# Altium schematic sheet MotorController.SchDoc: Motor Controller
size A3; Address1: Department of ECSE; Address2: The University of Auckland; Address3: 20 Symonds Street; Address4: Auckland, NZ; Revision: 1.0; SheetNumber: 3; SheetTotal: 3
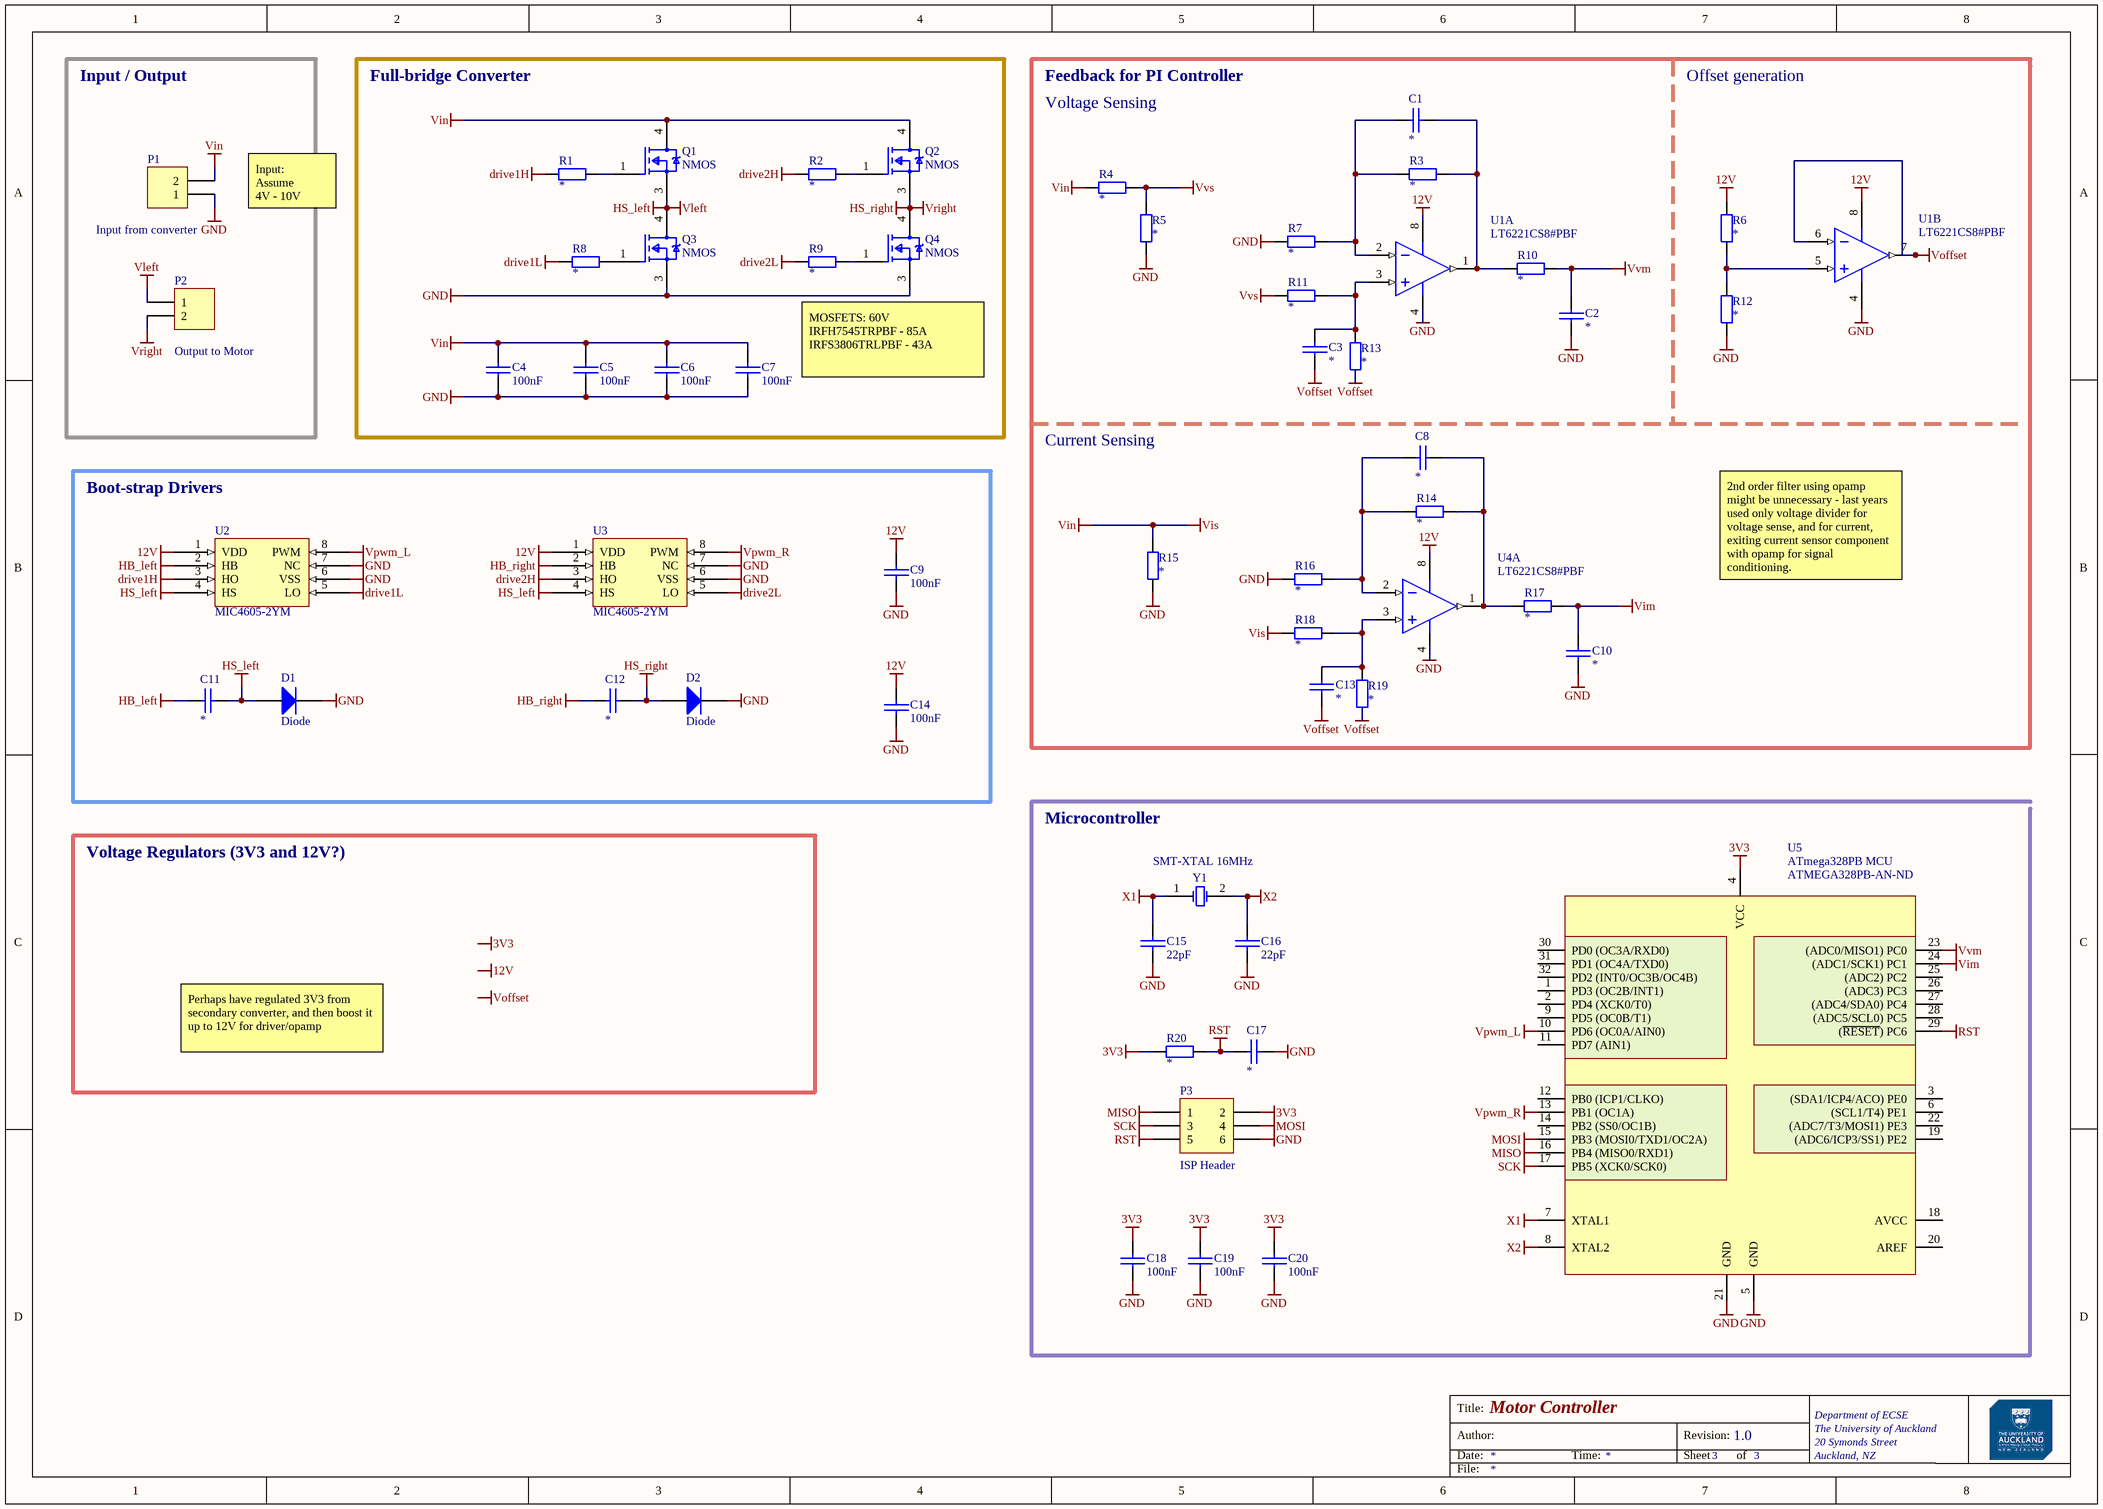
[diagram p0: MotorController.SchDoc]

## Parts
C1  *  [0805 CAP]
C2  *  [0805 CAP]
C3  *  [0805 CAP]
C4  100nF  [0805 CAP]
C5  100nF  [0805 CAP]
C6  100nF  [0805 CAP]
C7  100nF  [0805 CAP]
C8  *  [0805 CAP]
C9  100nF  [0805 CAP]
C10  *  [0805 CAP]
C11  *  [0805 CAP]
C12  *  [0805 CAP]
C13  *  [0805 CAP]
C14  100nF  [0805 CAP]
C15  22pF  [0805 CAP]
C16  22pF  [0805 CAP]
C17  *  [0805 CAP]
C18  100nF  [0805 CAP]
C19  100nF  [0805 CAP]
C20  100nF  [0805 CAP]
D1  Diode  [SMC]
D2  Diode  [SMC]
P1  Input from converter  [HDR1X2H]
P2  Output to Motor  [HDR1X2H]
P3  ISP Header  [HDR2X3]
Q1  NMOS  [IRFS3806TRLPBFCT-ND]
Q2  NMOS  [IRFS3806TRLPBFCT-ND]
Q3  NMOS  [IRFS3806TRLPBFCT-ND]
Q4  NMOS  [IRFS3806TRLPBFCT-ND]
R1  *  [0805 RES]
R2  *  [0805 RES]
R3  *  [0805 RES]
R4  *  [0805 RES]
R5  *  [0805 RES]
R6  *  [0805 RES]
R7  *  [0805 RES]
R8  *  [0805 RES]
R9  *  [0805 RES]
R10  *  [0805 RES]
R11  *  [0805 RES]
R12  *  [0805 RES]
R13  *  [0805 RES]
R14  *  [0805 RES]
R15  *  [0805 RES]
R16  *  [0805 RES]
R17  *  [0805 RES]
R18  *  [0805 RES]
R19  *  [0805 RES]
R20  *  [0805 RES]
U1  LT6221CS8#PBF  [LT-S8-8_N]  (parts A,B of 2)
U2  MIC4605-2YM
U3  MIC4605-2YM
U4  LT6221CS8#PBF  [LT-S8-8_N]  (part A of 2)
U5  ATmega328PB MCU  Supplier Part Number 1: ATMEGA328PB-AN-ND  [32 - TQFP]
Y1  SMT-XTAL 16MHz  [HC49-US]

## Blocks framed on the sheet
Input / Output: P1 P2
Full-bridge Converter: C4-C7 Q1-Q4 R1 R2 R8 R9
Boot-strap Drivers: C9 C11 C12 C14 D1 D2 U2 U3

## Nets
3V3: C18.1 C19.1 C20.1 P3.2 R20.2 U5.4(VCC)
12V: C9.2 C14.2 R6.2 U1.8(VS+) U2.1(VDD) U3.1(VDD) U4.8(VS+)
drive1H: R1.1 U2.3(HO)
drive1L: R8.1 U2.5(LO)
drive2H: R2.1 U3.3(HO)
drive2L: R9.1 U3.5(LO)
GND: C2.1 C4.1 C5.1 C6.1 C7.1 C9.1 C10.1 C14.1 C15.2 C16.2 C17.2 C18.2 C19.2 C20.2 D1.2(K) D2.2(K) P1.1 P3.6 Q3.3(S) Q4.3(S) R5.2 R7.1 R12.1 R15.2 R16.1 U1.4(VS-) U2.6(VSS) U2.7(NC) U3.6(VSS) U3.7(NC) U4.4(VS-) U5.5(GND) U5.21(GND)
HB_left: C11.1 U2.2(HB)
HB_right: C12.1 U3.2(HB)
HS_left: C11.2 D1.1(A) P2.1 Q1.3(S) Q3.4(D) U2.4(HS) U3.4(HS)  [also labelled Vleft]
HS_right: C12.2 D2.1(A) P2.2 Q2.3(S) Q4.4(D)  [also labelled Vright]
MISO: P3.1 U5.16(PB4_(MISO0/RXD1))
MOSI: P3.4 U5.15(PB3_(MOSI0/TXD1/OC2A))
RST: C17.1 P3.5 R20.1 U5.29((~{RESET})_PC6)
SCK: P3.3 U5.17(PB5_(XCK0/SCK0))
Vim: C10.2 R17.1 U5.24((ADC1/SCK1)_PC1)
Vin: C4.2 C5.2 C6.2 C7.2 P1.2 Q1.4(D) Q2.4(D) R4.2 R15.1 R18.1  [also labelled Vis]
Voffset: C3.1 C13.1 R13.1 R19.1 U1.6(-IN_B) U1.7(OUT_B)
Vpwm_L: U2.8(PWM) U5.10(PD6_(OC0A/AIN0))
Vpwm_R: U3.8(PWM) U5.13(PB1_(OC1A))
Vvm: C2.2 R10.1 U5.23((ADC0/MISO1)_PC0)
Vvs: R4.1 R5.1 R11.1
X1: C15.1 U5.7(XTAL1) Y1.1(OSC1)
X2: C16.1 U5.8(XTAL2) Y1.2(OSC2)
NetC1_1: C1.1 R3.2 R7.2 U1.2(-IN_A)
NetC1_2: C1.2 R3.1 R10.2 U1.1(OUT_A)
NetC3_2: C3.2 R11.2 R13.2 U1.3(+IN_A)
NetC8_1: C8.1 R14.2 R16.2 U4.2(-IN_A)
NetC8_2: C8.2 R14.1 R17.2 U4.1(OUT_A)
NetC13_2: C13.2 R18.2 R19.2 U4.3(+IN_A)
NetQ1_1: Q1.1(G) R1.2
NetQ2_1: Q2.1(G) R2.2
NetQ3_1: Q3.1(G) R8.2
NetQ4_1: Q4.1(G) R9.2
NetR6_1: R6.1 R12.2 U1.5(+IN_B)

Not connected (* = marked no-connect by the designer): U5 1(PD3_(OC2B/INT1)) 2(PD4_(XCK0/T0)) 3((SDA1/ICP4/ACO)_PE0) 6((SCL1/T4)_PE1) 9(PD5_(OC0B/T1)) 11(PD7_(AIN1)) 12(PB0_(ICP1/CLKO)) 14(PB2_(SS0/OC1B)) 18(AVCC) 19((ADC6/ICP3/SS1)_PE2) 20(AREF) 22((ADC7/T3/MOSI1)_PE3) 25((ADC2)_PC2) 26((ADC3)_PC3) 27((ADC4/SDA0)_PC4) 28((ADC5/SCL0)_PC5) 30(PD0_(OC3A/RXD0)) 31(PD1_(OC4A/TXD0)) 32(PD2_(INT0/OC3B/OC4B))

## Notes on the sheet
- Feedback for PI Controller
- Voltage Sensing
- Offset generation
- Input:
  Assume
  4V - 10V
- MOSFETS: 60V
  IRFH7545TRPBF - 85A
  IRFS3806TRLPBF - 43A
- Current Sensing
- 2nd order filter using opamp might be unnecessary - last years used only voltage divider for voltage sense, and for current, exiting current sensor component with opamp for signal conditioning.
- Voltage Regulators (3V3 and 12V?)
- Microcontroller
- Perhaps have regulated 3V3 from secondary converter, and then boost it up to 12V for driver/opamp
- Labels drawn without touching a wire or pin: 3V3, 12V, Voffset
- Title:
- Author:
- Date:
- Time:
- Revision:
- Sheet
- of
- File:

## Library data of the parts
C1-C20 = CerCap_SMT_0805: SMT ceramic capacitor 0805 size; Value: *
D1 D2 = Diode: Default Diode; Published: 8-Jun-2000; LatestRevisionDate: 17-Jul-2002; LatestRevisionNote: Re-released for DXP Platform.; PackageVersion: Sep-1996; PackageReference: SMC; Publisher: Altium Limited; PackageDescription: DO-214-AB/SMC; 2 C-Bend Leads; Body 7.9 x 5.9 mm, inc. leads (LxW); Code_JEDEC: DO-214-AB
P1 P2 = Header 2H: Header, 2-Pin, Right Angle; LatestRevisionDate: 17-Jul-2002; LatestRevisionNote: Re-released for DXP Platform.; Publisher: Altium Limited
P3 = Header 3X2: Header, 3-Pin, Dual row; LatestRevisionDate: 17-Jul-2002; LatestRevisionNote: Re-released for DXP Platform.; Publisher: Altium Limited
Q1-Q4 = NMOS: Single N-Channel 60V 15.8 mOhm 22 nC HEXFET® Power Mosfet - D2PAK; Manufacturer: Infineon; Manufacturer Part Number: IRFS3806TRLPBF; Continuous Drain Current (ID): 43A; Turn-Off Delay Time: 49ns; Turn-On Delay Time: 6.3ns; Gate to Source Voltage (Vgs): 20V; Rds On Max: 15.8mR; Input Capacitance: 1.15nF; Max Power Dissipation: 71W; Supplier 1: Digi-Key; Supplier 2: Digi-Key; RoHS: Yes; Category: MOSFETs; Stock 2: 500; Pricing 2: 1=1.40000, 10=1.25200, 100=0.97650 (USD); Mount: Surface Mount; Case/Package: D2PAK; Number of Pins: 3; Min Operating Temperature: -55°C; Max Operating Temperature: 175°C; Packaging: Tape and Reel; Drain to Source Voltage (Vdss): 60V; Power Dissipation: 71W; Drain to Source Resistance: 15.8mR; Max Dual Supply Voltage: 60V; Length: 0.42inch; Width: 0.38inch; Height: 0.19inch; Lead Free: Contains Lead; RoHS Compliant: Yes; Halogen Free: Halogen Free; ComponentLink1URL: http://www.farnell.com/datasheets/44036.pdf?src-supplier=Farnell; ComponentLink1Description: http://www.farnell.com/datasheets/44036.pdf?src-supplier=Farnell; ComponentLink2URL: https://www.alliedelec.com/m/d/06bed90ab4252f6c7a4191c63da86f41.pdf?src-supplier=Allied+Electronics; ComponentLink2Description: https://www.alliedelec.com/m/d/06bed90ab4252f6c7a4191c63da86f41.pdf?src-supplier=Allied+Electronics; ComponentLink3URL: http://www.infineon.com/dgdl/irfs3806pbf.pdf?fileId=5546d462533600a401535636ace4217a&src-supplier=Digi-Key; ComponentLink3Description: http://www.infineon.com/dgdl/irfs3806pbf.pdf?fileId=5546d462533600a401535636ace4217a&src-supplier=Digi-Key; ComponentLink4URL: https://www.infineon.com/dgdl/irfs3806pbf.pdf?fileId=5546d462533600a401535636ace4217a&src-supplier=Digi-Key; ComponentLink4Description: https://www.infineon.com/dgdl/irfs3806pbf.pdf?fileId=5546d462533600a401535636ace4217a&src-supplier=Digi-Key; ComponentLink5URL: http://www.farnell.com/datasheets/44036.pdf?src-supplier=Newark; ComponentLink5Description: http://www.farnell.com/datasheets/44036.pdf?src-supplier=Newark; Supplier 3: Digi-Key; Stock 3: 500; Pricing 3: 1=1.40000, 10=1.25200, 100=0.97650 (USD)
R1-R20 = Res_SMT_0805: 0805 resistor; Published: 8-Jun-2000; LatestRevisionDate: 17-Jul-2002; LatestRevisionNote: Re-released for DXP Platform.; PackageReference: AXIAL-0.4; Publisher: Altium Limited; Value: *; ComponentLink1Description: https://nz.mouser.com/datasheet/2/315/AOA0000C304-1149620.pdf
U1 U4 = CMP-0359-02678-2: Dual Channel, Low Power Precision Operational Amplifier, RRIO, 60 MHz Typical GBW, 20 V/us Typical SR, 2.2 to 12.6 V, 8-Pin SOIC (S8-8), Commercial, Pb-Free; Linear Technology Part Number: LT6221; Manufacturer: Linear Technology; Vos (mV) Typical: 0.07; GBW (MHz) Typical: 60; Is (mA) Typical: 0.9; Vs Max (V): 12.6; Channels (#): 2; SR (V/us) Typical: 20; Vs Min (V): 2.2; Vos (mV) Guaranteed: 0.35; PartNumber: LT6221CS8#PBF; Mounting Technology: Surface Mount; RoHS: Pb-Free; Type: VFB; ComponentLink1URL: http://www.linear.com/; ComponentLink2URL: http://cds.linear.com/docs/en/datasheet/622012fa.pdf; ComponentLink3URL: http://cds.linear.com/docs/en/packaging/05081610_G_SO8.pdf; ComponentLink2Description: Datasheet; PackageDescription: 8-Pin Plastic Small Outline, Body 4.9 x 3.9 mm, Pitch 1.27 mm; ComponentLink3Description: Package Specification; PackageReference: LT-S8-8; ComponentLink1Description: Manufacturer URL; RevisionNote: URLs updated; PackageVersion: Rev G
U2 U3 = MIC4605-2YM: Driver 1A 2-OUT High and Low Side Half Brdg Non-Inv 8-Pin SOIC N Tube; Manufacturer: Microchip; Manufacturer Part Number: MIC4605-2YM-T5; Number of Drivers: 2; Max Supply Voltage: 16V; Min Supply Voltage: 5.5V; Number of Outputs: 1; Rise Time: 20ns; Nominal Supply Current: 135uA; Output Voltage: 1.9V; Element Configuration: Single; Propagation Delay: 35ns; Channel Type: Independent; Supplier 1: Digi-Key; RoHS: Yes; Category: Gate Drivers; Pricing 1: 1=1.39000 (USD); Mount: Surface Mount; Case/Package: SOIC; Number of Pins: 8; Min Operating Temperature: -40°C; Max Operating Temperature: 125°C; Packaging: Tape and Reel; Package Quantity: 500; Max Output Current: 1A; Fall Time: 20ns; Length: 4.93mm; Width: 3.94mm; Height: 1.63mm; Radiation Hardening: No; RoHS Compliant: Yes; Lead Free: Lead Free; ComponentLink1URL: https://datasheet.ciiva.com/26948/getdatasheetpartid-789737-26948139.pdf?src-supplier=Verical; ComponentLink1Description: https://datasheet.ciiva.com/26948/getdatasheetpartid-789737-26948139.pdf?src-supplier=Verical; Supplier 2: Digi-Key; Stock 2: 88; Pricing 2: 1=0.95000, 25=0.78440, 100=0.72080 (USD); REACH SVHC: No SVHC; ComponentLink2URL: https://datasheet.ciiva.com/28655/1785059-28655117.pdf?src-supplier=Element14; ComponentLink2Description: https://datasheet.ciiva.com/28655/1785059-28655117.pdf?src-supplier=Element14
U5 = ATmega328PB_SMT_TQFP32: IC MCU 8BIT 32KB FLASH 32TQFP; Manufacturer: Atmel; Manufacturer Part Number: ATMEGA328PB-AN; Core Processor: AVR; Core Size: 8-Bit; Speed: 20MHz; Connectivity: I²C, SPI, UART/USART; Peripherals: Brown-out Detect/Reset, POR, PWM, WDT; Number of I/O: 27; Program Memory Size: 32KB (16K x 16); EEPROM Size: 1K x 8; RAM Size: 2K x 8; Voltage - Supply (Vcc/Vdd): 1.8 V ~ 5.5 V; Data Converters: A/D 8x10b; Oscillator Type: Internal; Supplier 1: Digi-Key; RoHS: RoHS Compliant; Category: Integrated Circuits (ICs); Stock 1: 366; Pricing 1: 1=2.74, 10=2.448, 25=2.2032, 100=2.0074, 250=1.81152, 500=1.62548, 1000=1.37088 (USD); Packaging: Tray; Part Status: Active; Program Memory Type: FLASH; Operating Temperature: -40°C ~ 105°C (TA); Package / Case: 32-TQFP; Supplier Device Package: 32-TQFP (7x7); ComponentLink1URL: http://www.atmel.com/images/atmel-42397-8-bit-avr-microcontroller-atmega328pb_datasheet.pdf; ComponentLink1Description: http://www.atmel.com/images/atmel-42397-8-bit-avr-microcontroller-atmega328pb_datasheet.pdf
Y1 = TXC9C-16_XTAL_SMT: 9C-16.000MAAJ-T crystal 16.0000MHZ 18PF SMD; Manufacturer: TXC CORPORATION; Frequency Stability: ±30ppm; Operating Mode: Fundamental; Supplier 1: Digi-Key; Manufacturer Part Number: 9C-16.000MAAJ-T; RoHS: RoHS Compliant; Category: Crystals, Oscillators, Resonators; Stock 1: 11514; Pricing 1: 1=0.75, 10=0.628, 50=0.5656, 100=0.5026, 500=0.47744 (NZD); Packaging: Cut Tape (CT); Part Status: Active; Type: MHz Crystal; Frequency Tolerance: ±30ppm; Load Capacitance: 18pF; Operating Temperature: -20°C ~ 70°C; Ratings: -; Mounting Type: Surface Mount; Package / Case: HC-49/US; Size / Dimension: 0.449" L x 0.189" W (11.40mm x 4.80mm); Height - Seated (Max): 0.161" (4.10mm); ComponentLink1URL: http://www.txccorp.com/download/products/quartz_crystals/2015TXC_9C_32.pdf; ComponentLink1Description: http://www.txccorp.com/download/products/quartz_crystals/2015TXC_9C_32.pdf; Supplier Part Number 1: 887-1059-1-ND